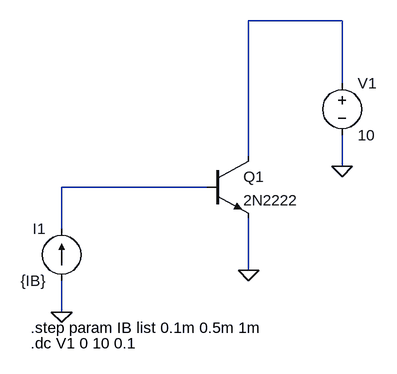
[diagram p0: schematic Assignment 4-1 - Output characteristic (IC vs VCE).asc]
Assignment 4-1 - Output characteristic (IC vs VCE).asc, the LTspice schematic file:
Version 4.1
SHEET 1 880 680
WIRE 368 -112 224 -112
WIRE 368 -16 368 -112
WIRE 224 96 224 -112
WIRE 368 112 368 64
WIRE 160 144 -64 144
WIRE -64 208 -64 144
WIRE 224 272 224 192
WIRE -64 336 -64 288
FLAG 224 272 0
FLAG 368 112 0
FLAG -64 336 0
SYMBOL npn 160 96 R0
SYMATTR InstName Q1
SYMATTR Value 2N2222
SYMBOL voltage 368 -32 R0
WINDOW 123 0 0 Left 0
WINDOW 39 0 0 Left 0
SYMATTR InstName V1
SYMATTR Value 10
SYMBOL current -64 288 R180
WINDOW 0 24 80 Left 2
WINDOW 3 24 0 Left 2
WINDOW 123 0 0 Left 0
WINDOW 39 0 0 Left 0
SYMATTR InstName I1
SYMATTR Value {IB}
TEXT -112 360 Left 2 !.step param IB list 0.1m 0.5m 1m
TEXT -112 384 Left 2 !.dc V1 0 10 0.1

The netlist it stands for:
* Assignment 4-1 - Output characteristic (IC vs VCE).asc
Q1 N001 N002 0 0 2N2222
V1 N001 0 10
I1 0 N002 {IB}
.model NPN NPN
.model PNP PNP
.lib standard.bjt
.step param IB list 0.1m 0.5m 1m
.dc V1 0 10 0.1
.backanno
.end